# EAGLE design micromod-fc (EAGLE 9.6.2)
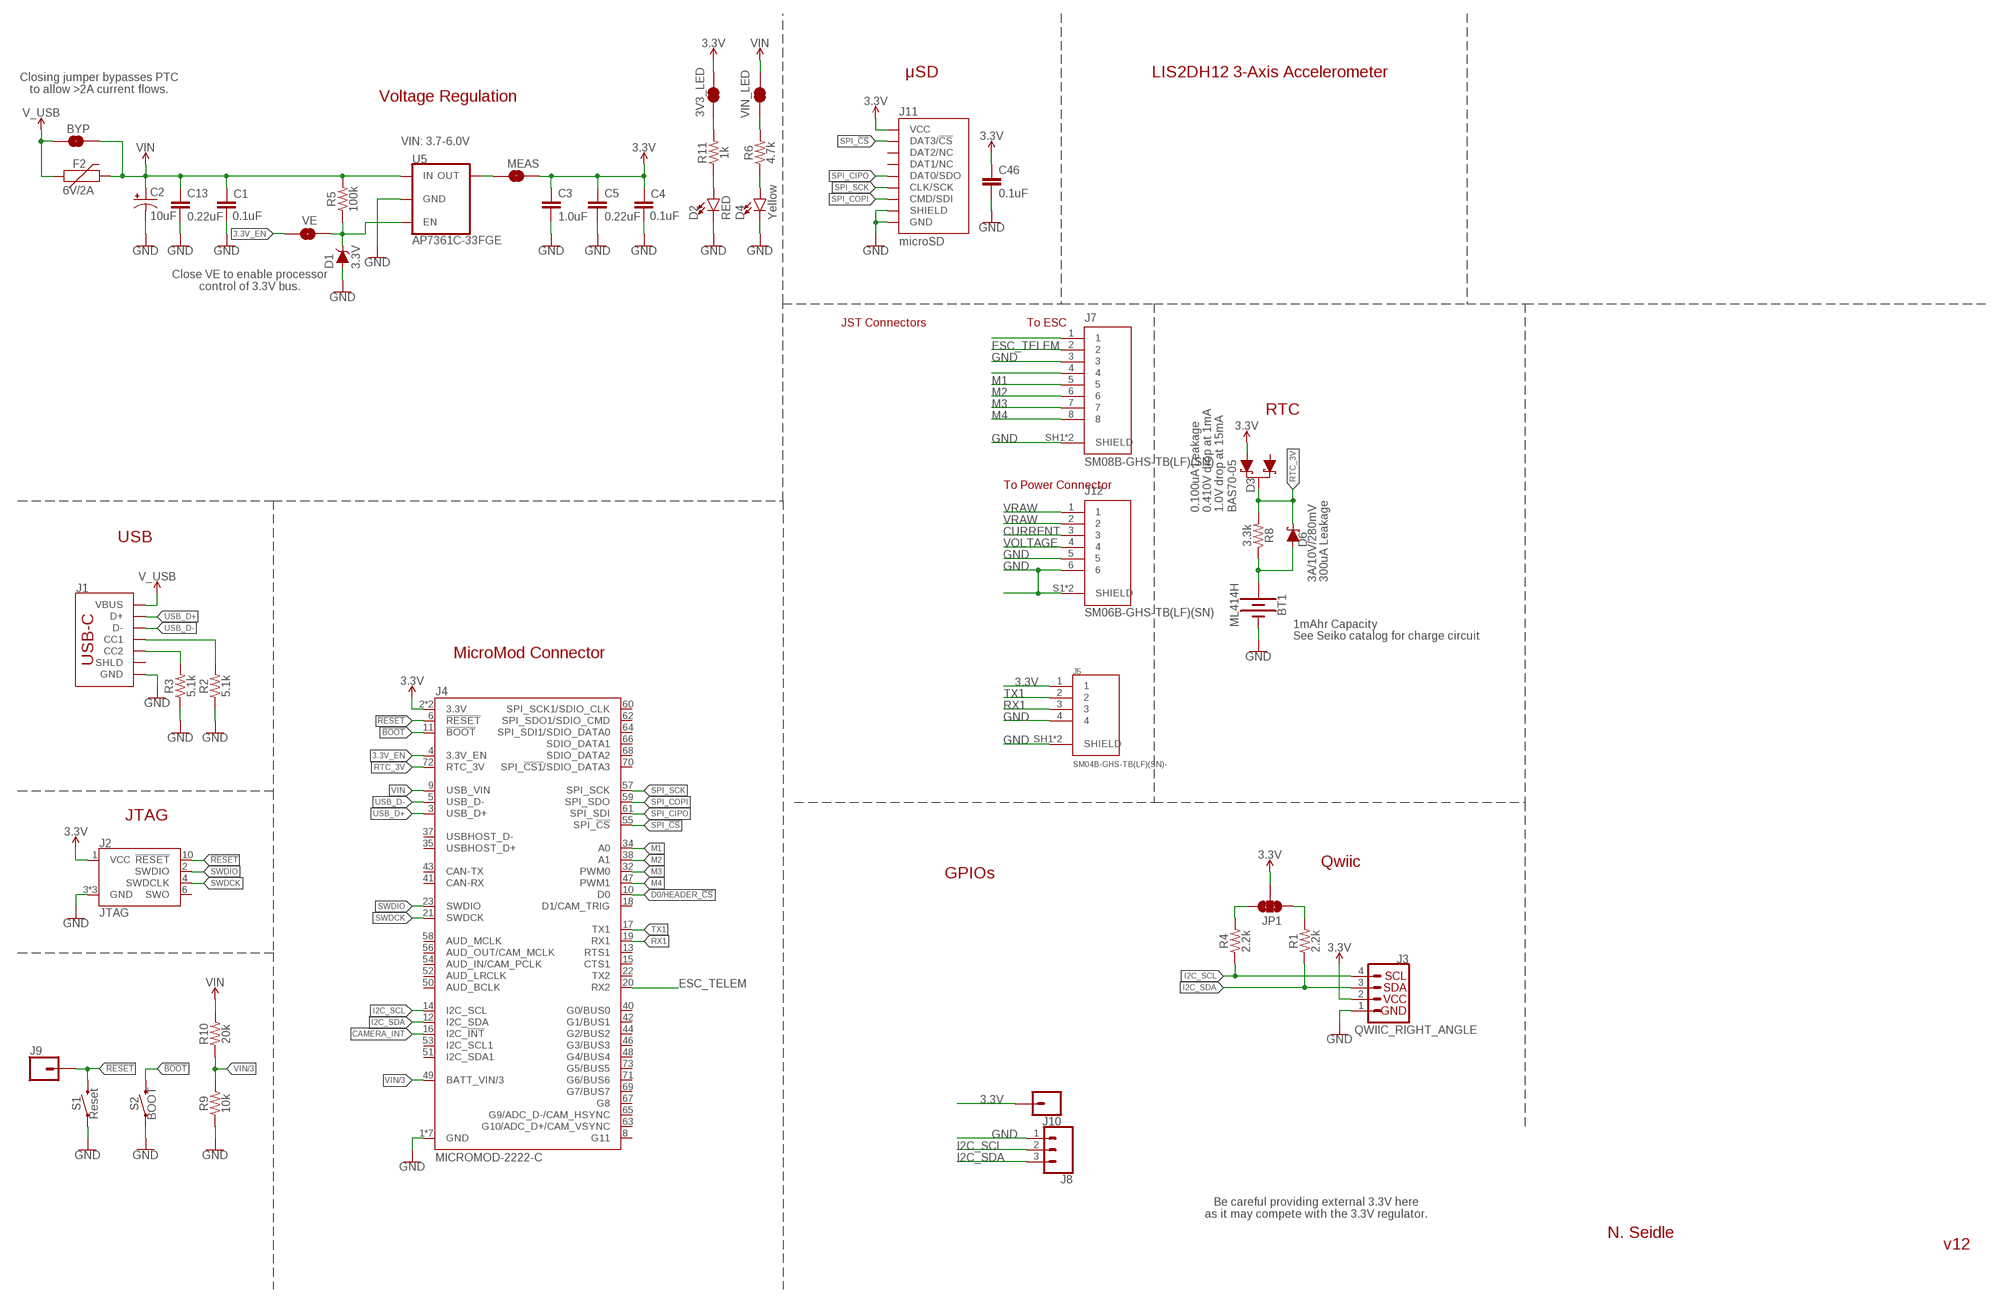
[diagram p0: schematic, sheet 1]

## Parts
3V3_LED  JUMPER-SMT_2_NC_TRACE_SILK  [SMT-JUMPER_2_NC_TRACE_SILK]
BT1  ML414H  ML414H_IV01E_BATTERY  [ML414H_IV01E]
BYP  JUMPER-SMT_2_NO_SILK  [SMT-JUMPER_2_NO_SILK]
C1  0.1uF  0.1UF-0603-25V-(+80/-20%)  [0603]
C2  10uF  10UF-POLAR-EIA3216-16V-10%(TANT)  [EIA3216]
C3  1.0uF  1.0UF-0603-16V-10%  [0603]
C4  0.1uF  0.1UF-0603-25V-(+80/-20%)  [0603]
C5  0.22uF  0.22UF-0603-25V-10%  [0603]
C13  0.22uF  0.22UF-0603-25V-10%  [0603]
C46  0.1uF  0.1UF-0603-25V-(+80/-20%)  [0603]
D1  3.3V  DIODE-ZENER-MM3Z3V3T1G  [SOD-323]
D2  RED  LED-RED0603  [LED-0603]
D3  BAS70-05  DIODE-SCHOTTKY-DUAL  [SOT23-3]
D4  Yellow  LED-YELLOW0603  [LED-0603]
D6  3A/10V/280mV  DIODE-SCHOTTKY-BAT60A  [SOD-323]
F2  6V/2A  PPTC_6V2A  [1210]
J1  USB_C_2-LAYER_PADS  [USB-C-16P-2LAYER-PADS]
J2  JTAG  CORTEX_JTAG_DEBUG_MINIMUM_PTH  [2X5-PTH-1.27MM]
J3  QWIIC_RIGHT_ANGLE  QWIIC_CONNECTORJS-1MM  [JST04_1MM_RA]
J4  MICROMOD-2222-C  [M.2-CONNECTOR-E]
J5  SM04B-GHS-TB(LF)(SN)-  [JST_SM04B-GHS-TB(LF)(SN)-]
J7  SM08B-GHS-TB(LF)(SN)  [JST_SM08B-GHS-TB(LF)(SN)]
J8  CONN_03  [1X03]
J9  CONN_01PTH_NO_SILK_YES_STOP  [1X01_NO_SILK]
J10  CONN_01  [1X01]
J11  microSD  MICRO-SD-SDIOPUSH-PUSH  [MICRO-SD-SOCKET]
J12  SM06B-GHS-TB(LF)(SN)  [JST_SM06B-GHS-TB(LF)(SN)]
JP1  JUMPER-SMT_3_2-NC_TRACE_SILK  [SMT-JUMPER_3_2-NC_TRACE_SILK]
MEAS  JUMPER-COMBO_2_NC_TRACE  [COMBO-JUMPER_2_NC_TRACE]
R1  2.2k  2.2KOHM-0603-1/10W-1%  [0603]
R2  5.1k  5.1KOHM5.1KOHM-0603-1/10W-1%  [0603]
R3  5.1k  5.1KOHM5.1KOHM-0603-1/10W-1%  [0603]
R4  2.2k  2.2KOHM-0603-1/10W-1%  [0603]
R5  100k  100KOHM-0603-1/10W-1%  [0603]
R6  4.7k  4.7KOHM-0603-1/10W-1%  [0603]
R8  3.3k  3.3KOHM-0603-1/10W-1%  [0603]
R9  10k  10KOHM-0603-1/10W-1%  [0603]
R10  20k  20KOHM-0603-1/10W-1%  [0603]
R11  1k  1KOHM-0603-1/10W-1%  [0603]
S1  Reset  MOMENTARY-SWITCH-SPST-SMD-5.2-TALL-REDUNDANT  [TACTILE_SWITCH_SMD_5.2MM]
S2  BOOT  MOMENTARY-SWITCH-SPST-SMD-5.2-TALL-REDUNDANT  [TACTILE_SWITCH_SMD_5.2MM]
U5  AP7361C-33FGE  AP7361C-33FGEUDFN-8  [UDFN-8]
VE  JUMPER-SMT_2_NO_SILK  [SMT-JUMPER_2_NO_SILK]
VIN_LED  JUMPER-SMT_2_NC_TRACE_SILK  [SMT-JUMPER_2_NC_TRACE_SILK]

## Nets
3.3V: 3V3_LED.2 C3.1 C4.1 C5.1 C46.1 D3.2(A1) J2.1(VCC) J3.2 J4.2(3.3V) J4.74(3.3V) J5.1 J10.1 J11.VCC JP1.2 MEAS.2 MEAS.4
3.3V_EN: J4.4(3.3V_EN) VE.1
!BOOT!: J4.11(!BOOT!) S2.3 S2.4
!RESET!: J2.10(!RESET) J4.6(!RESET!) J9.1 S1.3 S1.4
CAMERA_INT: J4.16(I2C_!INT!)
CURRENT: J12.3
D0/HEADER_!CS!: J4.10(D0)
ESC_TELEM: J4.20(RX2) J7.2
GND: BT1.- C1.2 C2.- C3.2 C4.2 C5.2 C13.2 C46.2 D1.A D2.C D4.C J1.GND J1.GND2(GND) J2.3(GND) J2.5(GND) J2.9(GND) J3.1 J4.1(GND) J4.7(GND) J4.33(GND) J4.36(GND) J4.39(GND) J4.45(GND) J4.75(GND) J5.4 J5.SH1(SHIELD) J5.SH2(SHIELD) J7.3 J7.SH1(SHIELD) J7.SH2(SHIELD) J8.1 J11.CD1(SHIELD) J11.GND J11.GND1(GND) J11.GND3(GND) J12.5 J12.6 J12.S1(SHIELD) J12.S2(SHIELD) R2.1 R3.1 R9.1 S1.1 S1.2 S2.1 S2.2 U5.4(GND) U5.EP(GND)
I2C_SCL: J3.4 J4.14(I2C_SCL) J8.2 R4.1
I2C_SDA: J3.3 J4.12(I2C_SDA) J8.3 R1.1
M1: J4.34(A0) J7.5
M2: J4.38(A1) J7.6
M3: J4.32(PWM0) J7.7
M4: J4.47(PWM1) J7.8
N$1: R6.2 VIN_LED.1
N$2: JP1.3 R4.2
N$3: JP1.1 R1.2
N$6: 3V3_LED.1 R11.2
N$7: D2.A R11.1
N$8: D4.A R6.1
N$9: J7.1
N$10: J1.A5(CC1) R2.2
N$11: J1.B5(CC2) R3.2
N$12: D1.C R5.1 U5.5(EN) VE.2
N$14: BT1.+ D6.A R8.1
N$16: J7.4
RTC_3V: D3.3(C) D6.C J4.72(RTC_3V) R8.2
RX1: J4.19(RX1) J5.3
SPI_!CS!: J4.55(SPI_!CS!) J11.CS/DAT3(DAT3/!CS!)
SPI_CIPO: J4.61(SPI_SDI) J11.DO/DAT0(DAT0/SDO)
SPI_COPI: J4.59(SPI_SDO) J11.DI/CMD(CMD/SDI)
SPI_SCK: J4.57(SPI_SCK) J11.SCLK(CLK/SCK)
SWDCK: J2.4(SWDCLK) J4.21(SWDCK)
SWDIO: J2.2(SWDIO) J4.23(SWDIO)
TX1: J4.17(TX1) J5.2
USB_D+: J1.A6(D+) J1.B6(D+) J4.3(USB_D+)
USB_D-: J1.A7(D-) J1.B7(D-) J4.5(USB_D-)
V_USB: BYP.1 F2.1 J1.VBUS1(VBUS) J1.VBUS2(VBUS)
VIN: BYP.2 C1.1 C2.+ C13.1 F2.2 J4.9(USB_VIN) R5.2 R10.2 U5.8(IN) VIN_LED.2
VIN/3: J4.49(BATT_VIN/3) R9.2 R10.1
VOLTAGE: J12.4
VRAW: J12.1 J12.2
VREG_3.3V: MEAS.1 MEAS.3 U5.1(OUT)
Unconnected: D3.1(A) J1.SHLD1(SHLD) J1.SHLD2(SHLD) J1.SHLD3(SHLD) J1.SHLD4(SHLD) J2.6(SWO) J4.8(G11) J4.13(RTS1) J4.15(CTS1) J4.18(D1/CAM_TRIG) J4.22(TX2) J4.35(USBHOST_D+) J4.37(USBHOST_D-) J4.40(G0/BUS0) J4.41(CAN-RX) J4.42(G1/BUS1) J4.43(CAN-TX) J4.44(G2/BUS2) J4.46(G3/BUS3) J4.48(G4/BUS4) J4.50(AUD_BCLK) J4.51(I2C_SDA1) J4.52(AUD_LRCLK) J4.53(I2C_SCL1) J4.54(AUD_IN/CAM_PCLK) J4.56(AUD_OUT/CAM_MCLK) J4.58(AUD_MCLK) J4.60(SPI_SCK1/SDIO_CLK) J4.62(SPI_SDO1/SDIO_CMD) J4.63(G10/ADC_D+/CAM_VSYNC) J4.64(SPI_SDI1/SDIO_DATA0) J4.65(G9/ADC_D-/CAM_HSYNC) J4.66(SDIO_DATA1) J4.67(G8) J4.68(SDIO_DATA2) J4.69(G7/BUS7) J4.70(SPI_!CS1!/SDIO_DATA3) J4.71(G6/BUS6) J4.73(G5/BUS5) J11.DAT1(DAT1/NC) J11.DAT2(DAT2/NC)

## Notes on the sheet
- μSD | LIS2DH12 3-Axis Accelerometer
- Closing jumper bypasses PTC
  to allow >2A current flows.
- Voltage Regulation
- VIN: 3.7-6.0V
- Close VE to enable processor
  control of 3.3V bus.
- JST Connectors | To ESC
- RTC
- To Power Connector
- 0.100uA Leakage
  0.410V drop at 1mA
  1.0V drop at 15mA
- USB
- 300uA Leakage
- 1mAhr Capacity
- See Seiko catalog for charge circuit
- MicroMod Connector
- JTAG
- Qwiic
- GPIOs
- Be careful providing external 3.3V here
  as it may compete with the 3.3V regulator.
- N. Seidle
- v12

## Library data of the parts
3V3_LED VIN_LED = SparkFun-Jumpers:JUMPER-SMT_2_NC_TRACE: Normally closed trace jumper This jumper has a trace between two pads so it's normally closed (NC). Use a razor knife to open the connection. For best results follow the IPC guidelines for cutting traces: Cutout at least 0.063 mm (0.005 in). Remove all loose material to clean up the cut area. Seal the cut with an approved epoxy. Reapply solder to reclose the connection.
BT1 = SparkFun-Batteries:ML414H_IV01E_BATTERY: SEIKO ML414H-IV01E Reflowable Lithium Battery ML414H is a rechargeable, coin type battery with features such as Pb-free reflowable (Peak temperature: 260 C) and high temperature heat resistance. Battery Characteristics: 3.1V max voltage Voff is 2V 1mAH 3k series resistor with battery 72 hour charge time from 2.0-3.1V 2.3-2.8V initial charge; PROD_ID: BATT-14267
BYP VE = SparkFun-Jumpers:JUMPER-SMT_2_NO: Normally open jumper This jumper has two pads in close proximity to each other. Apply solder to close the connection. Round pads are easier to solder for beginners, but are a lot larger. SparkFun Product that uses the round pads: SparkFun EL Sequencer <https://www.sparkfun.com/products/12781>
C1 C4 C46 = SparkFun-Capacitors:0.1UF: 0.1µF ceramic capacitors A capacitor is a passive two-terminal electrical component used to store electrical energy temporarily in an electric field.; PROD_ID: CAP-00810
C2 = SparkFun-Capacitors:10UF-POLAR: 10.0µF polarized capacitors A capacitor is a passive two-terminal electrical component used to store electrical energy temporarily in an electric field.; PROD_ID: CAP-00811
C3 = SparkFun-Capacitors:1.0UF: 1µF ceramic capacitors A capacitor is a passive two-terminal electrical component used to store electrical energy temporarily in an electric field.; PROD_ID: CAP-00868
C5 C13 = SparkFun-Capacitors:0.22UF: 0.22µF ceramic capacitors A capacitor is a passive two-terminal electrical component used to store electrical energy temporarily in an electric field.; PROD_ID: CAP-07822
D1 = SparkFun-DiscreteSemi:DIODE-ZENER: Zener Diode A Zener diode allows current to flow from its anode to its cathode like a normal semiconductor diode, but it also permits current to flow in the reverse direction when its "Zener voltage" is reached. - WIkipedia; PROD_ID: DIO-11284
D2 = SparkFun-LED:LED-RED: Red SMD LED Used in manufacturing of most products at SparkFun Packages: 0603 - SMD 0603 package [Product Link] <http://docs.avagotech.com/docs/AV02-0551EN> 0603 SMART - SMD 0603 SMART package ( more efficient and expensive)[Product Link] <http://www.osram-os.com/Graphics/XPic2/00077099_0.pdf> 1206 - SMD1206 package [Product Link] <https://www.sparkfun.com/datasheets/DevTools/LilyPad/Q150OVS4.pdff> SparkFun Products: Pro Mini 328 -5V <https://www.sparkfun.com/products/821> RedBoard <https://www.sparkfun.com/products/12757> IOIO-OTG <https://www.sparkfun.com/products/13613>; PROD_ID: DIO-00819
D3 = SparkFun-DiscreteSemi:DIODE-SCHOTTKY-DUAL: Diodes Incorporated - BAS70-05 Dual Schottky Diode Two Schottky Diodes in a single SOT-23 package. Low reverse current (100 nA) Vf: Datasheet referenced for footprint <https://www.diodes.com/assets/Datasheets/ds11007.pdf>; PROD_ID: DIO-14829
D4 = SparkFun-LED:LED-YELLOW: Yellow SMD LED Used in manufacturing several products at SparkFun. Packages: 0603 - SMD 0603 package[Product Link] <http://www.kingbrightusa.com/product.asp?catalog_name=LED&product_id=APT1608SYCK> 0603 -SMART - SMART SMD 0603 package (more efficient/more expensive) [Product Link] <http://www.osram-os.com/osram_os/en/products/product-catalog/led-light-emitting-diodes/smartled-0603/ly-l29k/index.jsp> LilyPad - SMD1206 package[Product Datasheet] <https://www.sparkfun.com/datasheets/DevTools/LilyPad/Q150YUS4.pdf> SparkFun Products: Blynk Board <https://www.sparkfun.com/products/13794> IOIO-OTG <https://www.sparkfun.com/products/13613> XBee Explorer Serial <https://www.sparkfun.com/products/13225>; PROD_ID: DIO-09003
D6 = SparkFun-DiscreteSemi:DIODE-SCHOTTKY: Schottky diode A Schottky diode is a semiconductor diode which has a low forward voltage drop and a very fast switching action.; PROD_ID: DIO-14072
F2 = SparkFun-Fuses:PPTC: Resettable Fuse PPTC Resettable Fuse. Really a sort of resistor with a polymeric positive temperature coefficient whose resistance increases dramatically with an increase in temperature. When heated by the power passing through the resistance rises causing the current to be limited, protecting the circuit. This is achieved by the transition of the polymer from a crystalline to an amorphous state where the conductive carbon separates breaking the conductive pathways found in the cool crystalline structure. When a PPTC cools back down it resumes conducting letting the circuit turn back on. SparkFun Products: SparkFun RedBoard - Programmed with Arduino <https://www.sparkfun.com/products/12757> Pro Micro - 5V/16MHz <https://www.sparkfun.com/products/12640> Arduino Pro 328 - 5V/16MHz <https://www.sparkfun.com/products/10915> MP3 Trigger <https://www.sparkfun.com/products/13720>; PROD_ID: RES-14313
J1 = SparkFun-Connectors:USB_C: USB Type C 16Pin Connector Super Speed pins not available on the 16-pin purely SMD connector so this part is best for USB 2.0 implementations. D1 and D2 are tied together enabling D+/- no matter which way the cable is plugged into the connector. The two channel configuration pins (CC1/2) are exposed. These are normally connected to ground via 5.1k resistors but can be reconfigured for high current/high power applications.; PROD_ID: CONN-14122
J2 = SparkFun-Connectors:CORTEX_JTAG_DEBUG_MINIMUM: Cortex Debug Connector - 10 pin Supports JTAG debug, Serial Wire debug, and Serial Wire Viewer. PTH and SMD connector options available. General Connector Information <http://infocenter.arm.com/help/topic/com.arm.doc.faqs/attached/13634/cortex_debug_connectors.pdf> Products: PTH Connector <http://www.digikey.com/product-detail/en/cnc-tech/3220-10-0100-00/1175-1627-ND/3883661> -via Digi-Key SparkFun PSoc <https://www.sparkfun.com/products/13229> SparkFun T <https://www.sparkfun.com/products/13810>
J3 = SparkFun-Connectors:QWIIC_CONNECTOR: SparkFun I2C Standard Qwiic Connector An SMD 1mm pitch JST connector makes it easy and quick (get it? Qwiic?) to connect I2C devices to each other. The Qwiic system <http://www.sparkfun.com/qwiic> enables fast and solderless connection between popular platforms and various sensors and actuators. We carry 200mm <https://www.sparkfun.com/products/14204>, 100mm <https://www.sparkfun.com/products/14205>, 50mm <https://www.sparkfun.com/products/14206>, and breadboard friendly <https://www.sparkfun.com/products/14207> Qwiic cables. We also offer 10 pcs strips <https://www.sparkfun.com/products/14323> the SMD connectors.; PROD_ID: CONN-13694
J4 = SparkFun-MicroMod:MICROMOD: MicroMod Connector Description: A card edge connector and mating PCB connector to allow various MicroMod Processor Boards to be coupled with various carrier boards of different capabilities. Based on the M.2 standard.; PROD_ID: CONN-14877
J5 = SM04B-GHS-TB_LF__SN_-:SM04B-GHS-TB(LF)(SN)-: Conn Header Gh Side 4pos 1.25mm; DESCRIPTION: Connector Header Surface Mount, Right Angle 4 position 0.049 (1.25mm); DIGI-KEY_PART_NUMBER: 455-1566-6-ND; MF: JST Sales; MP: SM04B-GHS-TB(LF)(SN)-; PACKAGE: None; PURCHASE-URL: https://pricing.snapeda.com/search/part/SM04B-GHS-TB(LF)(SN)-/?ref=eda
J7 = SM08B-GHS-TB_LF__SN_:SM08B-GHS-TB(LF)(SN): GH Series 8 Position 1.25 mm Pitch Side Entry Shrouded Header; DESCRIPTION: Connector Header Surface Mount, Right Angle 8 position 0.049 (1.25mm); DIGI-KEY_PART_NUMBER: 455-1570-1-ND; MF: JST Sales; MP: SM08B-GHS-TB(LF)(SN); PACKAGE: None
J8 = SparkFun-Connectors:CONN_03: Multi connection point. Often used as Generic Header-pin footprint for 0.1 inch spaced/style header connections On any of the 0.1 inch spaced packages, you can populate with these: Break Away Headers - Straight <https://www.sparkfun.com/products/116> (PRT-00116) Break Away Male Headers - Right Angle <https://www.sparkfun.com/products/553> (PRT-00553) Female Headers <https://www.sparkfun.com/products/115> (PRT-00115) Break Away Headers - Machine Pin <https://www.sparkfun.com/products/117> (PRT-00117) Break Away Female Headers - Swiss Machine Pin <https://www.sparkfun.com/products/743> (PRT-00743) Stackable Header - 3 Pin (Female, 0.1") <https://www.sparkfun.com/products/13875> (PRT-13875) For SCREWTERMINALS and SPRING TERMINALS visit here: Screw Terimnals on SparkFun.com <https://www.sparkfun.com/search/results?term=Screw+Terminals> (5mm/3.5mm/2.54mm spacing) This device is also useful as a general connection point to wire up your design to another part of your project. Our various solder wires solder well into these plated through hole pads. Hook-Up Wire - Assortment (Stranded, 22 AWG) <https://www.sparkfun.com/products/11375> (PRT-11375) Hook-Up Wire - Assortment (Solid Core, 22 AWG) <https://www.sparkfun.com/products/11367> (PRT-11367) View the entire wire category on our website here <https://www.sparkfun.com/categories/141> Special notes: Molex polarized connector foot print use with SKU : PRT-08232 with associated crimp pins and housings.
J9 J10 = SparkFun-Connectors:CONN_01: Single connection point. Often used as Generic Header-pin footprint for 0.1 inch spaced/style header connections On any of the 0.1 inch spaced packages, you can populate with these: Break Away Headers - Straight <https://www.sparkfun.com/products/116> (PRT-00116) Break Away Male Headers - Right Angle <https://www.sparkfun.com/products/553> (PRT-00553) Female Headers <https://www.sparkfun.com/products/115> (PRT-00115) Break Away Headers - Machine Pin <https://www.sparkfun.com/products/117> (PRT-00117) Break Away Female Headers - Swiss Machine Pin <https://www.sparkfun.com/products/743> (PRT-00743) This device is also useful as a general connection point to wire up your design to another part of your project. Our various solder wires solder well into these plated through hole pads. Hook-Up Wire - Assortment (Stranded, 22 AWG) <https://www.sparkfun.com/products/11375> (PRT-11375) Hook-Up Wire - Assortment (Solid Core, 22 AWG) <https://www.sparkfun.com/products/11367> (PRT-11367) View the entire wire category on our website here <https://www.sparkfun.com/categories/141> Special notes: SMTSO-256-ET is a "flush mount" nut for a 4-40 screw. We mostly use this on specialty testbeds; it is a nice way to connect hardware to your PCB at an adjustable hieght. Also note, the SNAP packages are for using a snappable style connector. We sell a baggie of snaps and they are also used on two LilyPad designs: Snap Assortment - 30 pack (male and female) <https://www.sparkfun.com/products/11347> (DEV-11347) LilyPad Arduino SimpleSnap <https://www.sparkfun.com/products/10941> (DEV-10941) LilyPad SimpleSnap Protoboard <https://www.sparkfun.com/products/10940> (DEV-10940)
J11 = SparkFun-Connectors:MICRO-SD-SDIO: microSD Socket for Transflash Push-push type µSD socket. tDoc lines correctly indicate media card edge positions when inserting (unlocked, locked, depressed). NOTE: CD1 and CD2 are connected internally, and the default detect state of the socket is detect pin to ground. SparkFun Products: WAV Trigger <https://www.sparkfun.com/products/13660> CAN-Bus Shield <https://www.sparkfun.com/products/13262> SparkFun Level Shifing microSD Breakout <https://www.sparkfun.com/products/13743>; PROD_ID: CONN-07820
J12 = SM06B-GHS-TB_LF__SN_:SM06B-GHS-TB(LF)(SN): GHS Series 1.25 mm Pitch Disc. Crimp Wire-to-Wire Connector Check prices <https://pricing.snapeda.com/parts/SM06B-GHS-TB%28LF%29%28SN%29/JST%20Sales/view-part?ref=eda>; AVAILABILITY: In Stock; DESCRIPTION: Connector Header Surface Mount, Right Angle 6 position 0.049 (1.25mm); MF: JST Sales; MP: SM06B-GHS-TB(LF)(SN); PACKAGE: None; PRICE: None; PURCHASE-URL: https://pricing.snapeda.com/search/part/SM06B-GHS-TB(LF)(SN)/?ref=eda
JP1 = SparkFun-Jumpers:JUMPER-SMT_3_2-NC_TRACE: Normally closed trace jumper (2 of 2 connections) This jumper has a trace between all three pads so they are normally closed (NC). Use a razor knife to open the connection(s). For best results follow the IPC guidelines for cutting traces: Cutout at least 0.063 mm (0.005 in). Remove all loose material to clean up the cut area. Seal the cut with an approved epoxy. Reapply solder to reclose the connection(s).
MEAS = SparkFun-Jumpers:JUMPER-COMBO_2_NC_TRACE
R1 R4 = SparkFun-Resistors:2.2KOHM: 2.2kΩ resistor A resistor is a passive two-terminal electrical component that implements electrical resistance as a circuit element. Resistors act to reduce current flow, and, at the same time, act to lower voltage levels within circuits. - Wikipedia; PROD_ID: RES-08272
R2 R3 = SparkFun-Resistors:5.1KOHM; PROD_ID: RES-12083
R5 = SparkFun-Resistors:100KOHM: 100kΩ resistor A resistor is a passive two-terminal electrical component that implements electrical resistance as a circuit element. Resistors act to reduce current flow, and, at the same time, act to lower voltage levels within circuits. - Wikipedia; PROD_ID: RES-07828
R6 = SparkFun-Resistors:4.7KOHM: 4.7kΩ resistor A resistor is a passive two-terminal electrical component that implements electrical resistance as a circuit element. Resistors act to reduce current flow, and, at the same time, act to lower voltage levels within circuits. - Wikipedia; PROD_ID: RES-07857
R8 = SparkFun-Resistors:3.3KOHM: 3.3kΩ resistor A resistor is a passive two-terminal electrical component that implements electrical resistance as a circuit element. Resistors act to reduce current flow, and, at the same time, act to lower voltage levels within circuits. - Wikipedia; PROD_ID: RES-07851
R9 = SparkFun-Resistors:10KOHM: 10kΩ resistor A resistor is a passive two-terminal electrical component that implements electrical resistance as a circuit element. Resistors act to reduce current flow, and, at the same time, act to lower voltage levels within circuits. - Wikipedia; PROD_ID: RES-00824
R10 = SparkFun-Resistors:20KOHM: 20kΩ resistor A resistor is a passive two-terminal electrical component that implements electrical resistance as a circuit element. Resistors act to reduce current flow, and, at the same time, act to lower voltage levels within circuits. - Wikipedia; PROD_ID: RES-09383
R11 = SparkFun-Resistors:1KOHM: 1kΩ resistor A resistor is a passive two-terminal electrical component that implements electrical resistance as a circuit element. Resistors act to reduce current flow, and, at the same time, act to lower voltage levels within circuits. - Wikipedia; PROD_ID: RES-07856
S1 S2 = SparkFun-Switches:MOMENTARY-SWITCH-SPST: Momentary Switch (Pushbutton) - SPST Normally-open (NO) SPST momentary switches (buttons, pushbuttons). Variants PTH-12MM - 12mm square, through-hole Momentary Pushbutton Switch - 12mm Square <https://www.sparkfun.com/products/9190> (COM-09190) PTH-6.0MM, PTH-6.0MM-KIT - 6.0mm square, through-hole Mini Pushbutton Switch <https://www.sparkfun.com/products/97> (COM-00097) KIT package intended for soldering kit's - only one side of pads' copper is exposed. PTH-RIGHT-ANGLE-KIT - Right-angle, through-hole Right Angle Tactile Button <https://www.sparkfun.com/products/10791> - Used on SparkFun BigTime Watch Kit <https://www.sparkfun.com/products/11734> SMD-12MM - 12mm square, surface-mount Tactile Button - SMD (12mm) <https://www.sparkfun.com/products/12993> (COM-12993) Used on SparkFun PicoBoard <https://www.sparkfun.com/products/11888> SMD-4.5MM - 4.5mm Square Trackball Switch Used on SparkFun Blackberry Trackballer Breakout <https://www.sparkfun.com/products/13169> SMD-4.6MMX2.8MM - 4.60mm x 2.80mm, surface mount Used on SparkFun SAMD21 Mini Breakout <https://www.sparkfun.com/products/13664> SMD-5.2MM, SMD-5.2-REDUNDANT - 5.2mm square, surface-mount Mini Pushbutton Switch - SMD <https://www.sparkfun.com/products/8720> (COM-08720) Used on Arduino Pro Mini <https://www.sparkfun.com/products/11114> REDUNDANT package connects both switch circuits together SMD-6.0X3.5MM - 6.0 x 3.5mm, surface mount Momentary Reset Switch SMD <https://www.sparkfun.com/products/8229> (COM-08229) SMD-6.2MM-TALL - 6.2mm square, surface mount Tactile Button - SMD (6mm) <https://www.sparkfun.com/products/12992> Used on SparkFun Digital Sandbox <https://www.sparkfun.com/products/12651> SMD-RIGHT-ANGLE - Right-angle, surface mount Used on SparkFun Block for Intel® Edison - Arduino <https://www.sparkfun.com/products/13036>; PROD_ID: SWCH-14139
U5 = SparkFun-IC-Power:AP7361C-33FGE: AP7361C 3.3V LDO Regulator; PROD_ID: VREG-14094

## Net classes
0 default: width 0 mm, drill 0 mm
1 power: width 0.762 mm

## Board
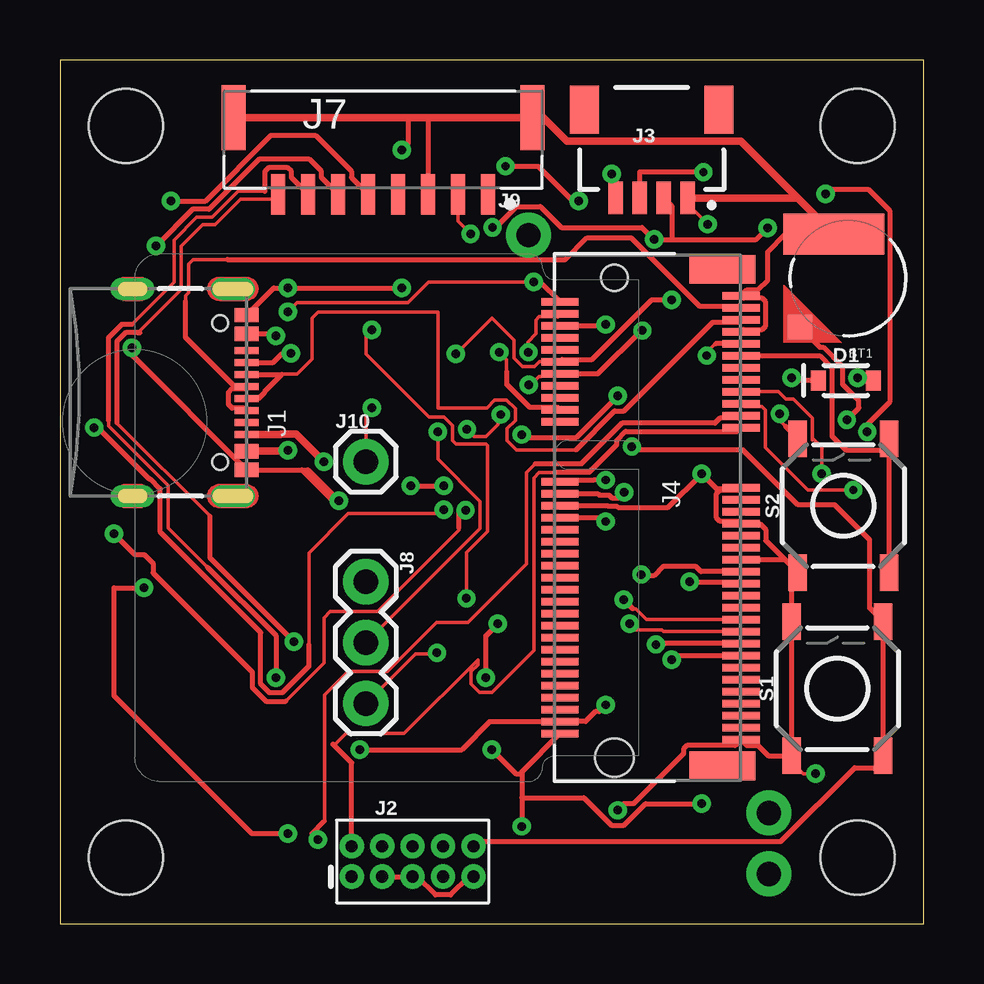
[diagram p1: board, top side]
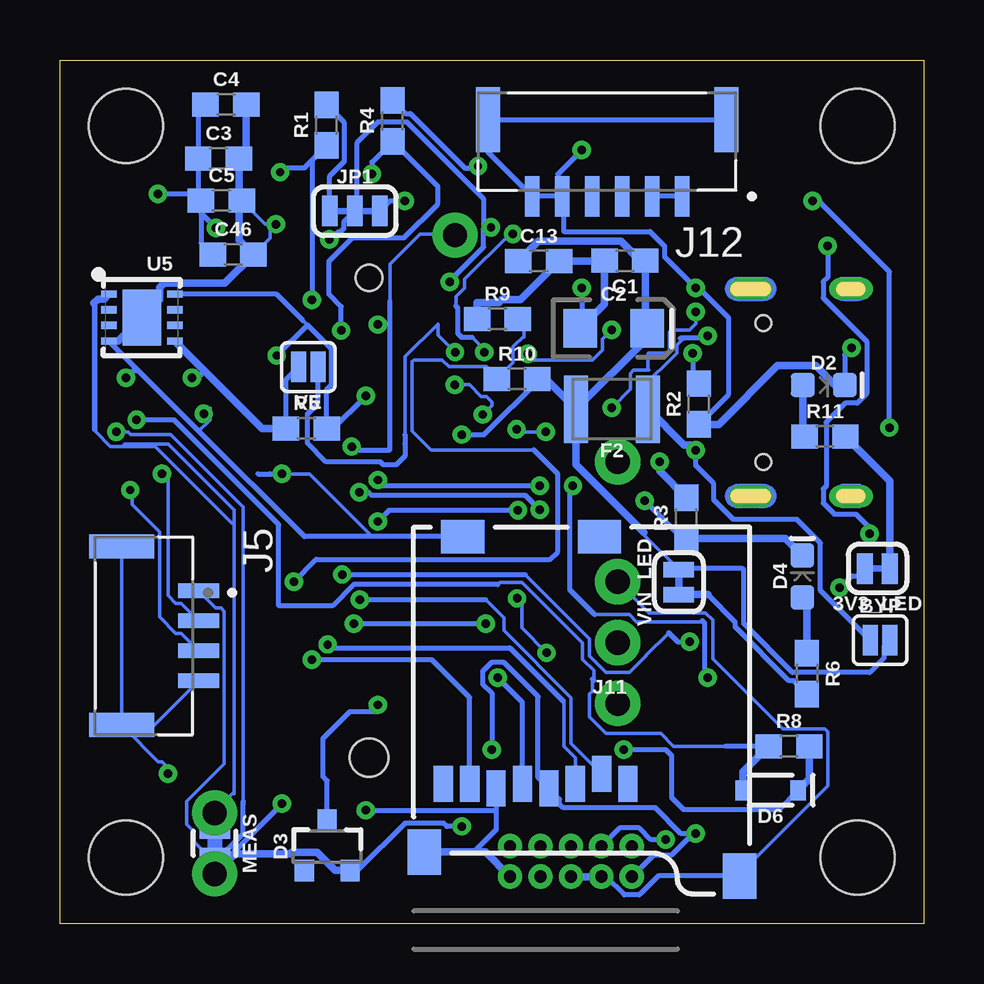
[diagram p2: board, bottom side, seen from below]

Size 36 x 36 mm. Coordinates in mm from the lower left corner, seen from the top.
Outline: 0,0 36,0 36,36 0,36 0,0
Copper layers (1*16): Top 0.035mm / dielectric 1.5mm / Bottom 0.035mm
Design rules "default": minimum track width 6mil, minimum drill 0.35mm, track to track 6mil, track to pad 6mil, pad to pad 6mil, via to via 6mil, smd to smd 6mil, copper to edge 40mil, drill to drill 6mil, minimum pad ring 10mil, minimum via ring 8mil, stop-mask expansion 4mil, vias tented up to drill 0mil, thermal gap 10mil
Holes 3.1 mm at 2.75,2.75 2.75,33.25 33.25,33.25 33.25,2.75

### Footprints (pad centres in the part's own frame; a part is rotated, then mirrored left to right if it is on the bottom)
SMT-JUMPER_2_NC_TRACE_SILK = smd 0.66 x 1.27: 1 -0.521,0; 2 0.521,0
ML414H_IV01E = smd 1 x 1: + 2.022,2.032 | smd 4.2 x 1.7: - 0.6,-1.85
SMT-JUMPER_2_NO_SILK = smd 0.635 x 1.27: 1 -0.406,0; 2 0.406,0
0603 = smd 1.1 x 1: 1 -0.85,0; 2 0.85,0
EIA3216 = smd 1.4 x 1.6: + 1.4,0; - -1.4,0
SOD-323 = smd 0.63 x 0.83: A 1.15,0; C -1.15,0
LED-0603 = smd 1 x 1: A -0.877,0; C 0.877,0
SOT23-3 = smd 0.8 x 0.9: 1 -0.95,-1; 2 0.95,-1; 3 0,1.1
1210 = smd 1 x 2.8: 1 -1.5,0; 2 1.5,0
USB-C-16P-2LAYER-PADS = smd 0.3 x 1: A5 -1.25,-0.34; A6 -0.25,-0.34; A7 0.25,-0.34; A8 1.25,-0.34; B5 1.75,-0.34; B6 0.75,-0.34; B7 -0.75,-0.34; B8 -1.75,-0.34 | smd 0.6 x 1: GND -3.225,-0.34; GND2 3.225,-0.34; VBUS1 -2.45,-0.34; VBUS2 2.45,-0.34 | drill 0.4 pad 0.6 long: SHLD1 -4.318,-0.915; SHLD2 4.318,-0.915; SHLD3 -4.318,-5.095; SHLD4 4.318,-5.095 | hole 0.65: -2.89,-1.445; 2.89,-1.445
2X5-PTH-1.27MM = drill 0.508 pad 1: 1 -2.54,-0.635; 2 -2.54,0.635; 3 -1.27,-0.635; 4 -1.27,0.635; 5 0,-0.635; 6 0,0.635; 7 1.27,-0.635; 8 1.27,0.635; 9 2.54,-0.635; 10 2.54,0.635
JST04_1MM_RA = smd 0.6 x 1.35: 1 -1.5,0; 2 -0.5,0; 3 0.5,0; 4 1.5,0 | smd 1.2 x 2: NC1 2.8,-3.675; NC2 -2.8,-3.675
M.2-CONNECTOR-E = smd 0.3 x 1.55: 1 9.25,-5.275; 2 9,2.275; 3 8.75,-5.275; 4 8.5,2.275; 5 8.25,-5.275; 6 8,2.275; 7 7.75,-5.275; 8 7.5,2.275; 9 7.25,-5.275; 10 7,2.275; 11 6.75,-5.275; 12 6.5,2.275; 13 6.25,-5.275; 14 6,2.275; 15 5.75,-5.275; 16 5.5,2.275; 17 5.25,-5.275; 18 5,2.275; 19 4.75,-5.275; 20 4.5,2.275; 21 4.25,-5.275; 22 4,2.275; 23 3.75,-5.275; 32 1.5,2.275; 33 1.25,-5.275; 34 1,2.275; 35 0.75,-5.275; 36 0.5,2.275; 37 0.25,-5.275; 38 0,2.275; 39 -0.25,-5.275; 40 -0.5,2.275; 41 -0.75,-5.275; 42 -1,2.275; 43 -1.25,-5.275; 44 -1.5,2.275; 45 -1.75,-5.275; 46 -2,2.275; 47 -2.25,-5.275; 48 -2.5,2.275; 49 -2.75,-5.275; 50 -3,2.275; 51 -3.25,-5.275; 52 -3.5,2.275; 53 -3.75,-5.275; 54 -4,2.275; 55 -4.25,-5.275; 56 -4.5,2.275; 57 -4.75,-5.275; 58 -5,2.275; 59 -5.25,-5.275; 60 -5.5,2.275; 61 -5.75,-5.275; 62 -6,2.275; 63 -6.25,-5.275; 64 -6.5,2.275; 65 -6.75,-5.275; 66 -7,2.275; 67 -7.25,-5.275; 68 -7.5,2.275; 69 -7.75,-5.275; 70 -8,2.275; 71 -8.25,-5.275; 72 -8.5,2.275; 73 -8.75,-5.275; 74 -9,2.275; 75 -9.25,-5.275 | smd 1.2 x 2.75: A1 10.35,-4.5; A2 -10.35,-4.5 | hole 1.1: 10,0 | hole 1.6: -10,0
JST_SM04B-GHS-TB(LF)(SN)- = smd 0.6 x 1.7: 1 -1.875,2.275; 2 -0.625,2.275; 3 0.625,2.275; 4 1.875,2.275 | smd 1 x 2.7: SH1 -3.725,-0.925; SH2 3.725,-0.925
JST_SM08B-GHS-TB(LF)(SN) = smd 0.6 x 1.7: 1 -4.375,0; 2 -3.125,0; 3 -1.875,0; 4 -0.625,0; 5 0.625,0; 6 1.875,0; 7 3.125,0; 8 4.375,0 | smd 1 x 2.7: SH1 -6.225,-3.2; SH2 6.225,-3.2
1X03 = drill 1.016 pad 1.88: 1 0,0; 2 2.54,0; 3 5.08,0
1X01_NO_SILK = drill 1.016 pad 1.88: 1 0,0
1X01 = drill 1.016 pad 1.88: 1 0,0
MICRO-SD-SOCKET = smd 1.8 x 1.4: CD1 -2.05,0.4; CD2 -7.75,0.4 | smd 0.8 x 1.5: CS/DAT3 -7.84,10.3; DAT1 -1.24,10.7; DAT2 -8.94,10.7; DI/CMD -6.74,10.7; DO/DAT0 -2.34,10.7; GND -3.44,10.9; SCLK -4.54,10.7; VCC -5.64,10.9 | smd 1.4 x 1.9: GND1 -13.6,14.55; GND3 -0.45,13.55
JST_SM06B-GHS-TB(LF)(SN) = smd 0.6 x 1.7: 1 -3.125,1.875; 2 -1.875,1.875; 3 -0.625,1.875; 4 0.625,1.875; 5 1.875,1.875; 6 3.125,1.875 | smd 1 x 2.7: S1 -4.975,-1.325; S2 4.975,-1.325
SMT-JUMPER_3_2-NC_TRACE_SILK = smd 0.66 x 1.27: 1 -1.041,0; 2 0,0; 3 1.041,0
COMBO-JUMPER_2_NC_TRACE = smd 0.635 x 1.27: 1 -0.508,0; 2 0.508,0 | drill 1.016 pad 1.88: 3 -1.27,0; 4 1.27,0
TACTILE_SWITCH_SMD_5.2MM = smd 1.524 x 0.762: 1 -2.794,1.905; 2 2.794,1.905; 3 -2.794,-1.905; 4 2.794,-1.905
UDFN-8 = smd 0.3 x 0.65: 1 -0.975,-1.375; 2 -0.325,-1.375; 3 0.325,-1.375; 4 0.975,-1.375; 5 0.975,1.375; 6 0.325,1.375; 7 -0.325,1.375; 8 -0.975,1.375 | smd 2.35 x 1.6: EP 0,0

### Placement (x,y rotation side)
3V3_LED  1.92,14.8 180 bottom
BT1  32.86,26.89 180 top
BYP  1.81,11.81 0 bottom
C1  12.45,27.64 180 bottom
C2  12.92,24.81 0 bottom
C3  29.39,31.89 0 bottom
C4  29.08,34.14 0 bottom
C5  29.27,30.14 0 bottom
C13  16.04,27.61 0 bottom
C46  28.78,27.89 0 bottom
D1  32.76,22.64 0 top
D2  4.16,22.45 0 bottom
D3  24.86,3.21 0 bottom
D4  5.05,14.47 90 bottom
D6  6.38,5.56 180 bottom
F2  12.99,21.44 180 bottom
J1  8.12,22.14 270 top
J2  14.7,2.59 0 top
J3  24.67,30.25 180 top
J4  23.12,16.92 90 top
J5  32.5,12 270 bottom
J7  13.47,30.4 180 top
J8  12.75,14.25 270 top
J9  19.53,28.7 0 top
J10  12.75,19.25 0 top
J11  21.26,16.53 180 bottom
J12  13.19,32.19 180 bottom
JP1  23.71,29.7 0 bottom
MEAS  29.55,3.34 270 bottom
R1  24.89,33.28 90 bottom
R2  9.36,21.66 90 bottom
R3  9.89,16.9 90 bottom
R4  22.14,33.46 90 bottom
R5  25.73,20.64 0 bottom
R6  4.86,10.42 270 bottom
R8  5.61,7.39 0 bottom
R9  17.76,25.2 0 bottom
R10  16.95,22.7 0 bottom
R11  4.11,20.3 0 bottom
S1  32.41,9.79 90 top
S2  32.66,17.42 90 top
U5  32.59,25.26 270 bottom
VE  25.65,23.2 180 bottom
VIN_LED  10.2,14.23 90 bottom

### Tracks (layer width: path | path; a pad name or v marks a point on that pad's centre or on a via)
3.3V  (via drill 0.35)
  Top 0.152: J10.1 12.75,21.25 v13,21.5 | v19.75,26.75 15.36,26.75 14.5,25.89 9.89,25.89 v9.5,25.5
  Top 0.2: J4.74 19.25,6.33 19.25,6.25 | 19.25,6.25 19.25,5.25 | 19.25,5.25 v19.25,4.05 | v9.5,3.75 8,3.75 2.25,9.5 2.25,14 v3.5,14 | v18,7.25 19,6.25 19.25,6.25 | J4.2 20.02,26.75 v19.75,26.75 | 25.5,28.52 v24.77,28.52 24.27,29.02 20.9,29.02 20.02,29.89 19.04,29.89 18.16,29.02 v18.03,29.02 | 25.5,28.52 29.02,28.52 v29.5,29 | J3.2 25.5,29.92 25.5,28.52 | 19.25,5.25 21.83,5.25 22.99,4.09 23.51,4.09 24.42,5 v26.75,5 | v33.65,20.5 33.65,20.8 34.61,21.76 34.61,29.7 33.72,30.58 32.08,30.58 v31.92,30.42
  Bottom 0.152: 28.36,5 28.36,17.36 31.39,20.39 33.06,20.39 33.17,20.5 33.75,20.5 | J5.1 29.5,13.15 29.28,13.15 29.15,13.02 29.15,6.67 30.72,5.09 30.72,4.13 30.41,3.82 30.41,3.41 29.55,2.54 MEAS.4 MEAS.2 29.26,2.83 28.79,3.29 28.75,3.25 28.75,3 | v13,21.5 12.22,22.28 12.22,22.93 12.09,23.07 11.44,23.07 11.5,23.13 11.5,23.75 11.47,23.78 10.72,23.78 10.59,23.91 10.59,24.66 10.5,24.75 9.76,24.75 9.5,25.01 v9.5,25.5
  Bottom 0.2: 27.85,2.91 27.75,2.91 25.3,2.91 24.6,2.21 D3.2 23.59,2.21 21.61,4.18 20,4.18 19.87,4.05 v19.25,4.05 | J2.1 11.25,2.87 10.49,2.87 9.61,3.75 v9.5,3.75 10.11,3.75 11.19,4.83 15.03,4.83 15.17,4.97 15.17,5.18 J11.VCC 16.07,6.08 16.07,9.46 17.49,10.88 18.01,10.88 18.38,10.51 18.38,9.99 18,9.61 v18,7.25 | 18.34,29 18.34,28.21 19.75,26.79 v19.75,26.75 | 18.34,29 18.34,30.21 21.54,33.41 22.75,33.41 23.63,32.53 23.63,29.78 JP1.2 24.17,29.24 24.17,28.96 24.32,28.81 24.44,28.81 24.75,28.5 v24.77,28.52 | C4.1 30.24,33.83 C3.1 30.24,30.26 C5.1 | C5.1 30.12,28.38 C46.1 | v29.5,29 30.12,29.62 C5.1 | 18.34,29 18.05,29 v18.03,29.02 | v26.75,5 28.75,3 29.55,2.2 MEAS.4 | 3V3_LED.2 2.74,14.5 3,14.5 v3.5,14 | 29.19,2.9 28.79,3.29 28.36,3.73 28.36,5 28.36,5.1 | 33.75,20.5 v33.65,20.5 | v31.92,30.42 30.4,30.42 C5.1
  Bottom 0.305: MEAS.4 28.71,2.91 27.75,2.91 26.39,2.91 26.34,2.96 25.28,2.96 24.53,2.21 D3.2
3.3V_EN  (via drill 0.35)
  Top 0.152: J4.4 20.72,25.3 19.98,25.3 19.84,25.16 19.84,24.59 19.5,24.25 19.5,23.85 v19.53,23.82
  Top 0.2: J4.4 20.75,25.32
  Bottom 0.152: v19.53,23.82 20.25,24.54 20.25,25 21.62,23.63 21.62,20
  Bottom 0.2: 21.62,20.38 21.62,20 21.62,19.49 21.99,19.12 22.51,19.12 22.64,19.25 24.9,19.25 25.68,20.04 25.68,21.25 25.24,21.68 VE.1
!BOOT!
  Top 0.2: J4.11 31.67,23.67 32.18,23.16 32.18,20.32 32.75,19.75 34.56,19.75 | S2.3 34.56,19.75 | 34.56,19.75 S2.4
!RESET!  (via drill 0.35)
  Top 0.2: J2.10 17.43,3.42 30.04,3.42 33.13,6.5 34.5,6.5 34.5,6.81 S1.3 S1.4 33.75,13.15 33.75,16 32.3,17.45 30.77,17.45 28.47,19.75 23.97,19.75 v23.84,19.88 | J4.6 22.67,24.92 22.75,25 v22.75,24.98
  Bottom 0.152: 22.25,25.93 22.25,27.5 21,28.75 19.58,28.75 J9.1
  Bottom 0.2: 22.25,25 22.25,19.75 23.71,19.75 v23.84,19.88 | 22.25,25 22.25,25.93 | v22.75,24.98 22.73,25 22.25,25
ESC_TELEM  (via drill 0.35)
  Top 0.152: v17.12,28.75 16.59,29.28 J7.2 | v18.32,23.82 18.62,23.52 18.62,23.44 18.62,23
  Top 0.2: J4.20 20.75,21.52 19.59,21.52 18.62,22.49 18.62,23
  Bottom 0.152: 19.5,25.75 19.5,26.14 19.14,26.5 19.14,26.86 17.25,28.75 v17.12,28.75 | 18.82,24.45 18.32,23.95 v18.32,23.82
  Bottom 0.2: 19.5,25.75 19.41,25.66 19.41,24.59 19.27,24.45 18.82,24.45
GND  (via drill 0.35)
  Top 0.152: v31.5,6.25 31,6.25 30.25,7 | 30.25,20.72 30,20.97 v30,21.25 | v27,29.15 26.17,29.98 26.17,30 | BT1.- 32.19,28.74 32.05,28.88
  Top 0.2: 28.36,18.14 28.3,18.07 27.52,18.07 27.37,17.93 27.37,16.91 27.52,16.77 28.3,16.77 J4.39 29.18,16.67 29.42,16.43 29.42,15.96 S2.1 | 28.36,18.14 J4.33 | J4.45 30.21,15.17 S2.1 | S2.1 30.5,14.38 S1.2 S1.1 30.25,7 29.53,7 29.1,7.42 28.64,7.42 J4.75 28.15,7.42 26.14,7.42 25.99,7.28 25.99,7.08 23.91,5 23.5,5 23.25,4.75 v23.25,4.73 | J2.9 17.05,1.96 16.29,1.2 15.65,1.2 14.89,1.96 J2.5 J2.3 | J1.GND2 10.09,18.91 11.5,17.5 v11.62,17.62 10.34,18.91 J1.GND2 | v14.25,26.5 v9.5,26.5 8.91,26.5 J1.GND | J1.GND2 3,23.7 v3,24 | 15.5,33.6 15.35,33.45 J7.3 | 26.17,29.73 26.17,30 J3.1 | J4.7 28.49,24.77 29.27,24.77 29.42,24.91 29.42,25.93 29.27,26.07 28.49,26.07 J4.1 28.64,26.42 29.1,26.42 29.5,26.82 29.5,28 30.24,28.74 BT1.- | 32.05,28.88 32.12,28.88 | v33.25,22.75 33.8,22.75 D1.A | S2.2 30.25,20.72 | 28.36,18.14 27.36,18.14 v26.75,18.75 25.35,17.35 23.26,17.35 23.21,17.4 22.85,17.4 22.83,17.42 J4.36 | 14.5,33.6 14.5,32.5 v14.25,32.25
  Top 0.305: J3.1 30.75,30.25 | 30.75,30.25 32.12,28.88 BT1.- | 30.75,30.25 28.38,32.62 21.14,32.62 20.16,33.6 J7.SH1 15.5,33.6 14.5,33.6 J7.SH2
  Bottom 0.152: J5.SH2 33.33,8.18 | 33.33,8.18 31.9,6.75 31.75,6.75 31.5,6.5 v31.5,6.25 | J5.SH1 33.42,8.57 34,8 33.5,8 33.38,8.12 | 33.38,8.12 33.33,8.18 | J5.4 32.23,8.12 33.38,8.12 | J8.1 11.46,12.96 9.1,12.96 8.79,12.65 8.79,11.04 5.87,8.12 4.12,8.12 3.98,7.99 3.98,5.75 7.75,1.98 | J11.CD1 19.23,16.15 23,16.15 25.6,18.75 27.25,18.75 | C46.2 27.25,28.57 27.25,29 27.1,29.15 v27,29.15 27.44,29.15 28.52,30.23 | 28.52,30.23 28.54,30.25 | C5.2 28.51,30.23 28.52,30.23 | v30,21.25 29.75,21.5 29.75,21 30.21,20.54
  Bottom 0.2: J11.GND1 7.75,1.98 11.06,1.98 11.85,1.2 12.47,1.2 13.23,1.96 13.75,1.96 | J11.CD1 25.81,16.13 30.21,20.54 32.72,23.04 | 32.72,23.04 U5.4 | v11.62,17.62 10.05,16.05 R3.1 | R2.1 8.12,22.05 8.12,25.25 9.37,26.5 v9.5,26.5 10.8,27.8 10.8,28.25 11.4,28.85 15,28.85 15,30.25 J12.5 15.25,30.32 | v14.25,26.5 14.25,24.88 C2.- | v3,24 3.28,23.72 D2.C | J11.GND 17.82,4.75 | 17.82,4.75 17.82,3.91 18.75,2.98 | v23.25,4.73 17.84,4.73 17.82,4.75 | J12.S1 J12.S2 18.16,32.16 J12.6 15.25,30.32 | 32.72,23.04 32.97,23.04 v33.25,22.75 | 27.75,18.75 27.25,18.75 v26.75,18.75 | v14.25,32.25 15.25,31.25 15.25,30.32
  Bottom 0.305: C3.2 28.54,31.75 | 28.54,31.75 28.54,30.25 28.54,28.5 C46.2 29.13,26.69 31.67,26.69 31.84,26.51 31.84,26 U5.EP 33.56,24.29 U5.4 | C4.2 28.23,32.06 28.54,31.75 | R9.1 18.61,25.89 17.7,25.89 17.59,26 16.8,26 C13.2 13.33,27.61 C1.2 13.3,25.83 C2.- | J2.9 18.27,2.98 18.75,2.98 J11.GND3 | J2.3 13.75,1.96 J2.5 | R2.1 8.53,20.81 6.08,23.25 4.5,23.25 3.69,22.45 D2.C | D4.C 5.75,16.05 R3.1
I2C_SCL  (via drill 0.35)
  Top 0.152: v15.75,20.5 15.75,19.36 17.52,17.59 17.52,16.48 J8.2 | v16.96,20.61 17.27,20.3 17.75,20.3 18.25,20.8 18.25,21.1 v18.37,21.22 | v19.54,22.46 19.64,22.46 19.98,22.8 20.05,22.8 20.25,23 20.92,23 21,22.92
  Top 0.2: J4.14 21,22.92 22.42,22.92 24.25,24.75 v24.28,24.72 | v23,31.25 23.17,31.08 J3.4
  Bottom 0.152: v16.96,20.61 16.86,20.5 v15.75,20.5 | v18.37,21.22 18,21.59 18,21.75 18.22,21.97 18.45,21.97 18.93,22.46 v19.54,22.46
  Bottom 0.2: v24.28,24.72 24.28,25.72 24.79,26.23 24.79,27.61 23.81,28.59 21.66,28.59 20.25,30 20.25,30.72 R4.1 23,31.75 v23,31.25
I2C_SDA  (via drill 0.35)
  Top 0.152: J8.3 14.83,11.25 15.68,11.25 v15.71,11.29 | v16.95,13.55 16.95,15.47 17.82,16.35 17.82,19.93 17.75,20 16.5,20 16.36,20.14 16.36,20.75 16,21.11 15.39,21.11 12.75,23.75 12.75,24.5 v13,24.75 | v16.5,23.75 18,25.25 18.92,24.33 18.92,23.57 19.28,23.21 19.78,23.21 19.99,23.42 J4.12
  Top 0.2: J4.12 20.94,23.52 22.18,23.52 24.67,26 v25.5,26 | J3.3 24.17,31.33 24.18,31.32 v26.82,31.32
  Bottom 0.152: v15.71,11.29 16.75,12.32 16.75,13.36 v16.95,13.55 | v13,24.75 13.39,24.36 13.39,23.91 13.81,23.5 16.25,23.5 v16.5,23.75
  Bottom 0.2: v25.5,26 25.5,31.82 R1.1 25.82,31.5 26.64,31.5 v26.82,31.32
M1  (via drill 0.35)
  Top 0.152: v16,17.25 15.84,17.09 12.02,17.09 10.38,15.45 10.38,11.63
  Top 0.2: J4.34 22.43,17.92 22.49,17.86 22.89,17.86 23,17.75 23.3,17.75 v23.52,17.98 | 10.38,11.63 10.38,10.74 9.26,9.62 8.74,9.62 8.37,9.99 8.37,12.13 4.18,16.32 4.18,18.11 3.77,18.53 3.72,18.53 1.5,20.75 v1.42,20.67 | v4.62,30.12 6.07,30.12 8.79,32.85 10.65,32.85 12.15,31.36 12.15,31.1 J7.5
  Bottom 0.2: v23.52,17.98 23.13,17.98 23.01,17.86 16.61,17.86 v16,17.25 | v1.42,20.67 1.42,27.17 4.5,30.25 v4.62,30.12
M2  (via drill 0.35)
  Top 0.152: 9.41,9.27 11,10.86 11,12.75 11.25,13 13.23,13 16.63,16.4 16.63,16.49
  Top 0.2: J4.38 22.59,16.92 v22.75,16.76 | v4,28.25 5.52,29.77 6.21,29.77 8.29,31.86 10.4,31.86 10.9,31.36 10.9,31.1 J7.6 | v2.25,16.25 3.12,15.38 3.51,15.38 3.88,15.01 3.88,14.62 8.02,10.48 8.02,9.84 8.59,9.27 9.41,9.27 | 16.63,16.49 16.63,17.13 16.75,17.25 16.89,17.25 v16.91,17.23
  Bottom 0.2: v4,28.25 4,26.94 4.18,26.75 4.18,26.08 2.37,24.26 2.37,22.09 2.77,21.7 3.27,21.7 4.06,20.91 4.06,18.24 4.18,18.11 4.18,17.53 3.72,17.07 2.81,17.07 2.25,16.5 v2.25,16.25 | v16.91,17.23 22.28,17.23 v22.75,16.76
M3  (via drill 0.35)
  Top 0.152: 3,24.98 4.75,26.73 4.75,28.5 5.69,29.44 6.35,29.44 7.42,30.52 8.54,30.52 | 2.02,20.97 2.02,20.94 2.03,20.93 2.03,20.73 4.51,18.25 4.51,16.49 6.15,14.85
  Top 0.2: 2.02,20.97 2.02,24.41 2.59,24.98 3,24.98 | 8.54,30.52 8.54,31.36 8.69,31.5 9.5,31.5 9.65,31.36 9.65,31.1 J7.7 | 6.15,14.85 9,12 v9,10.25 | v22.75,18.49 22.24,18.49 22.22,18.47 20.89,18.47 J4.32 | v14.62,18.25 v16,18.25
  Bottom 0.152: 9.18,12.57 11.96,12.57 12.27,12.88 13.23,12.88 13.24,12.88 13.71,12.88
  Bottom 0.2: v9,10.25 9.12,10.37 9.12,12.51 9.18,12.57 9.23,12.63 | 13.71,12.88 14.75,13.91 14.75,18.25 v14.62,18.25 | v16,18.25 22.75,18.25 v22.75,18.49
M4  (via drill 0.35)
  Top 0.152: 3.25,24.63 5.05,26.43 5.05,28.25 5.94,29.14 6.47,29.14 7.53,30.19 8.89,30.19 J7.8 | 6.25,16.99 2.37,20.87
  Top 0.2: 3.33,24.63 3.25,24.63 2.74,24.63 2.37,24.26 2.37,20.87 | J4.47 26.72,14.67 26.51,14.88 25.13,14.88 24.75,14.5 24.28,14.5 v24.24,14.55 | v9.75,11.75 6.25,15.25 6.25,16.99
  Bottom 0.152: 10.62,12.12 11.58,11.17 11.58,11.15 12.27,10.46 13.23,10.46 13.92,11.15 13.92,11.86 16.61,14.55
  Bottom 0.2: 10.63,12.13 10.62,12.12 10.25,11.75 v9.75,11.75 | v24.24,14.55 16.61,14.55
N$1
  Bottom 0.2: R6.2 5.41,10.12 5.61,10.12 7.85,12.36 7.85,12.56 9,13.71
  Bottom 0.305: 9,13.71 VIN_LED.1
N$2  (via drill 0.35)
  Top 0.2: v18.57,31.57 19.93,31.57 21.5,30 v21.62,30.12
  Bottom 0.2: R4.2 21.59,33.77 21.39,33.77 19.12,31.5 18.5,31.5 v18.57,31.57 | v21.62,30.12 22.24,30.12 JP1.3
N$3
  Bottom 0.2: JP1.1 24.75,31.16 24.14,31.77 24.14,33.38 R1.2
N$6
  Bottom 0.305: 3V3_LED.1 1.4,18.44 R11.2
N$7
  Bottom 0.305: D2.A 5.04,20.38 R11.1
N$8
  Bottom 0.305: R6.1 4.86,13.4 D4.A
N$10  (via drill 0.35)
  Top 0.2: J1.A5 8.89,23.39 9.27,23.77 v9.62,23.77
  Bottom 0.2: v9.62,23.77 9.62,22.77 R2.2
N$11  (via drill 0.35)
  Top 0.305: J1.B5 9.2,20.39 9.22,20.41 9.84,20.41 v11,19.25
  Bottom 0.305: R3.2 11,18.86 v11,19.25
N$12  (via drill 0.35)
  Top 0.2: D1.C 30.61,22.64 v30.5,22.75
  Bottom 0.2: R5.1 26.58,22.68 VE.2 | v30.5,22.75 30.25,22.75 29.96,23.04
  Bottom 0.305: R5.1 27.57,20.64 29.96,23.04 U5.5
N$14  (via drill 0.35)
  Top 0.2: BT1.+ 31.67,24.02 31.81,24.02 32.62,23.22 32.62,22.49 33.28,21.83 33.28,21.47 | v32.81,21 33.28,21.47 | 33.28,21.47 33.31,21.5
  Bottom 0.152: 8.25,7.39 10.43,7.39 10.96,7.92 13.23,7.92 13.92,8.61 13.92,9.57 13.81,9.68 13.81,10.19 | 13.75,10.13 13.75,10.55 14.22,11.02 14.22,11.69 16.75,14.22 17.66,14.22 17.75,14.13
  Bottom 0.2: 13.76,10.13 13.75,10.13 13.81,10.19 | R8.1 8.25,7.39 | 17.75,14.13 23.76,14.13 24.64,13.25 26.88,13.25 26.88,16.63 31.25,21 v32.81,21
  Bottom 0.305: R8.1 7.53,6.32 D6.A
RTC_3V  (via drill 0.35)
  Top 0.2: v12.5,7.25 16.75,7.25 17.92,8.42 J4.72 21.91,8.42 22.33,8.84 22.47,8.84 v22.75,9.11
  Bottom 0.2: D6.C 6.04,4.75 10,4.75 10.5,5.25 10.5,7 10.75,7.25 v12.5,7.25 | D3.3 24.86,5.95 25.04,6.13 25.04,7.71 23.91,8.84 22.75,8.84 v22.75,9.11
  Bottom 0.305: D6.C 4.76,6.03 R8.2
RX1  (via drill 0.35)
  Top 0.152: v33.07,18.07 31.18,18.07 29.4,19.85 29.4,21.41 29.27,21.55 28.52,21.55 J4.19
  Bottom 0.152: J5.3 30.95,12.1 31.17,12.1 31.85,12.77 31.85,16.32 33,17.47 33,18 v33.07,18.07
SPI_!CS!  (via drill 0.35)
  Top 0.152: 23.87,13.13 23.89,13.11 24,13.11 24.44,12.67 J4.55
  Top 0.2: v23.5,13.5 23.87,13.13
  Bottom 0.152: J11.CS/DAT3 14.69,7.5 14.69,9.41 17.5,12.21 17.5,12.75 18.25,13.5
  Bottom 0.2: 18.25,13.5 v23.5,13.5
SPI_CIPO  (via drill 0.35)
  Top 0.2: v25.5,11 25.67,11.17 J4.61
  Bottom 0.2: J11.DO/DAT0 18.92,9.42 20.5,11 v25.5,11
SPI_COPI  (via drill 0.35)
  Top 0.2: J4.59 24.92,11.67 24.75,11.5 24.75,11.54 v24.84,11.63
  Bottom 0.152: 15.02,9.27 15,9.25 15,7.38 14.52,6.9 J11.DI/CMD
  Bottom 0.2: v24.84,11.63 24.71,11.5 17.25,11.5 15.02,9.27
SPI_SCK  (via drill 0.35)
  Top 0.152: J4.57 25.16,12.17 25.1,12.24 24.01,12.24 v23.75,12.5
  Top 0.2: v17.75,10.25 17.75,12 v18.25,12.5
  Bottom 0.2: J11.SCLK 16.72,9.22 v17.75,10.25 | v18.25,12.5 v23.75,12.5
SWDCK  (via drill 0.35)
  Top 0.152: 19.82,19.18 19.45,18.8 19.45,15 17,12.55 15.7,12.55 13.66,10.51 12.02,10.51 11.04,9.53 11.04,4.29 11.02,4.27
  Top 0.2: J4.21 28.3,21.07 27.52,21.07 27.31,20.86 23.43,20.86 21.74,19.18 19.82,19.18 | 11.02,4.27 10.5,3.75 v10.75,3.5
  Bottom 0.2: v10.75,3.5 11.36,3.5 11.85,3.98 12.67,3.98 J2.4
SWDIO
  Top 0.152: 11.43,7.43 11.92,7.92 14.34,7.92 17.42,11 17.42,10.78 17.14,10.5 17.14,10 17.5,9.64 18,9.64 19.75,11.39 19.75,14.44 19.75,14.5 19.75,18.57 19.98,18.8 20.73,18.8 20.75,18.82
  Top 0.2: J4.23 28.24,20.51 23.58,20.51 23.21,20.14 23.21,19.96 22.07,18.82 20.75,18.82 20.71,18.82 | J2.2 12.16,6.7 11.43,7.43 11.37,7.49
TX1  (via drill 0.35)
  Top 0.152: 31.36,20.25 31.36,21.07 30.58,21.86 30.25,21.86 29.94,22.17 J4.17 | 31.36,20.16 31.36,20.25 | 31.36,20.25 31.75,19.86 v31.75,18.75
  Bottom 0.152: J5.2 30.95,13.35 31.17,13.35 31.5,13.68 31.5,18.5 v31.75,18.75
USB_D+
  Top 0.152: 5.23,25.94 5.23,26.18 5.36,26.31 5.36,27.5 5.54,27.68 6.98,27.68
  Top 0.2: 7.25,22.29 7.17,22.29 7.03,22.14 7.03,21.64 7.17,21.49 7.68,21.49 J1.B6 | 7.25,22.29 7.25,22.41 5.23,24.43 5.23,25.94 | 6.98,27.68 21.08,27.68 21.98,28.59 23.81,28.59 26.65,25.75 28.32,25.75 J4.3 | 7.25,22.29 7.68,22.29 J1.A6
USB_D-
  Top 0.152: 9.18,22.82 9.27,22.91 9.88,22.91 10.5,23.54 10.5,25.25 10.75,25.5 15.75,25.5 15.75,21.5 17.8,21.5 18.12,21.83 18.62,21.83 18.98,21.47 18.98,20.97 18.64,20.63 18.64,20.13 19.02,19.75 21.5,19.75
  Top 0.2: J4.5 28.3,25.07 27.21,25.07 23.51,21.37 23.12,21.37 21.5,19.75 | J1.B7 9.25,22.89 9.18,22.82 8.53,22.17 8.53,22.14 8.29,21.89 J1.A7
V_USB  (via drill 0.35)
  Top 0.2: J1.VBUS1 8.91,24.59 v9,24.5
  Top 0.305: J1.VBUS2 9.19,19.69 9.25,19.75 9.48,19.75 v9.5,19.73
  Bottom 0.152: 10,24.4 10.29,24.11 10.29,23.79 11.78,22.3 11.78,21.73
  Bottom 0.2: 11.78,21.73 F2.1 | v9,24.5 9.1,24.4 10,24.4 10.14,24.4 | v9.5,19.73 9.5,19.09 8.74,18.34 8.74,17.66 7.93,16.85 5.28,16.85 4.3,15.86 4.3,13.89 BYP.1
  Bottom 0.305: v9.5,19.73 9.73,19.95 9.99,19.95 11.47,21.44 F2.1
VIN  (via drill 0.35)
  Top 0.152: 27.33,24.17 26.96,23.8 v26.96,23.68
  Top 0.2: v23.25,22 21.5,20.25 19.38,20.25 v19.25,20.38 | J4.9 27.33,24.17
  Bottom 0.152: VIN_LED.2 11.66,16.21 11.66,16.31 | 25.69,24.95 25.87,25.13
  Bottom 0.2: 25.87,25.13 26.97,26.23 U5.8 | v23.25,22 24.61,20.64 R5.2 24.88,22.25 24.67,22.46 24.67,23.94 25.69,24.95 v26.96,23.68 | v19.25,20.38 18.32,20.38 16,22.7 | BYP.2 1.65,11.57 1.65,11.07 2.25,10.47 5.46,10.47 7.5,12.5 7.5,14.75 7.54,14.79 10.16,14.79
  Bottom 0.305: C13.1 16.05,28.45 12.62,28.45 11.82,27.64 C1.1 11.6,24.89 C2.+ 11.52,24.41 F2.2 | F2.2 15.75,22.7 16,22.7 R10.2 | F2.2 14.49,19.14 11.66,16.31 | VIN_LED.2 10.16,14.79
VIN/3  (via drill 0.35)
  Top 0.2: v26.25,14.25 28.32,14.25 J4.49
  Bottom 0.152: R9.2 16.66,24.95 16.66,24.5 | 16.66,24.5 16.66,24.45 | R10.1 17.75,22.75 | 17.75,22.75 17.11,23.39 17.11,24.05 16.66,24.5 | 17.75,22.75 18.21,23.21 19.78,23.21 20.07,23.5 21.25,23.5 21.32,23.43 21.32,20.54 20.52,19.75 16.25,19.75
  Bottom 0.2: v26.25,14.25 25.32,15.18 15.57,15.18 15.25,15.5 15.25,18.75 16.25,19.75
VRAW
  Bottom 0.2: J12.1 J12.2
VREG_3.3V
  Bottom 0.152: 33.4,19.89 33.3,20 31.5,20 28.75,17.25 28.75,5.5 | 34.52,20.51 34.59,20.58 34.59,25.86 | 33.4,19.89 33.91,19.89 34.52,20.51 | 33.4,19.89 32.03,19.89 28.84,16.7 | 34.52,20.51 34.52,25.83 | 28.75,5.5 28.75,5.41 | 28.75,5.5 29.55,4.7 MEAS.3 MEAS.1
  Bottom 0.305: 34.59,25.86 34.42,26.04 34.16,26.04 U5.1